# Altium schematic sheet LC_EXT_SCH.SchDoc: DEVCELL_V1
size A3; ApprovedBy: ?; CheckedBy: ?; Author: T.Suleymanli; CompanyName: SKA; DrawnBy: T.Suleymanli; Engineer: T.Suleymanli; Organization: SKA; Address1: Warszawa; DocumentNumber: #1; SheetNumber: 1; SheetTotal: 1
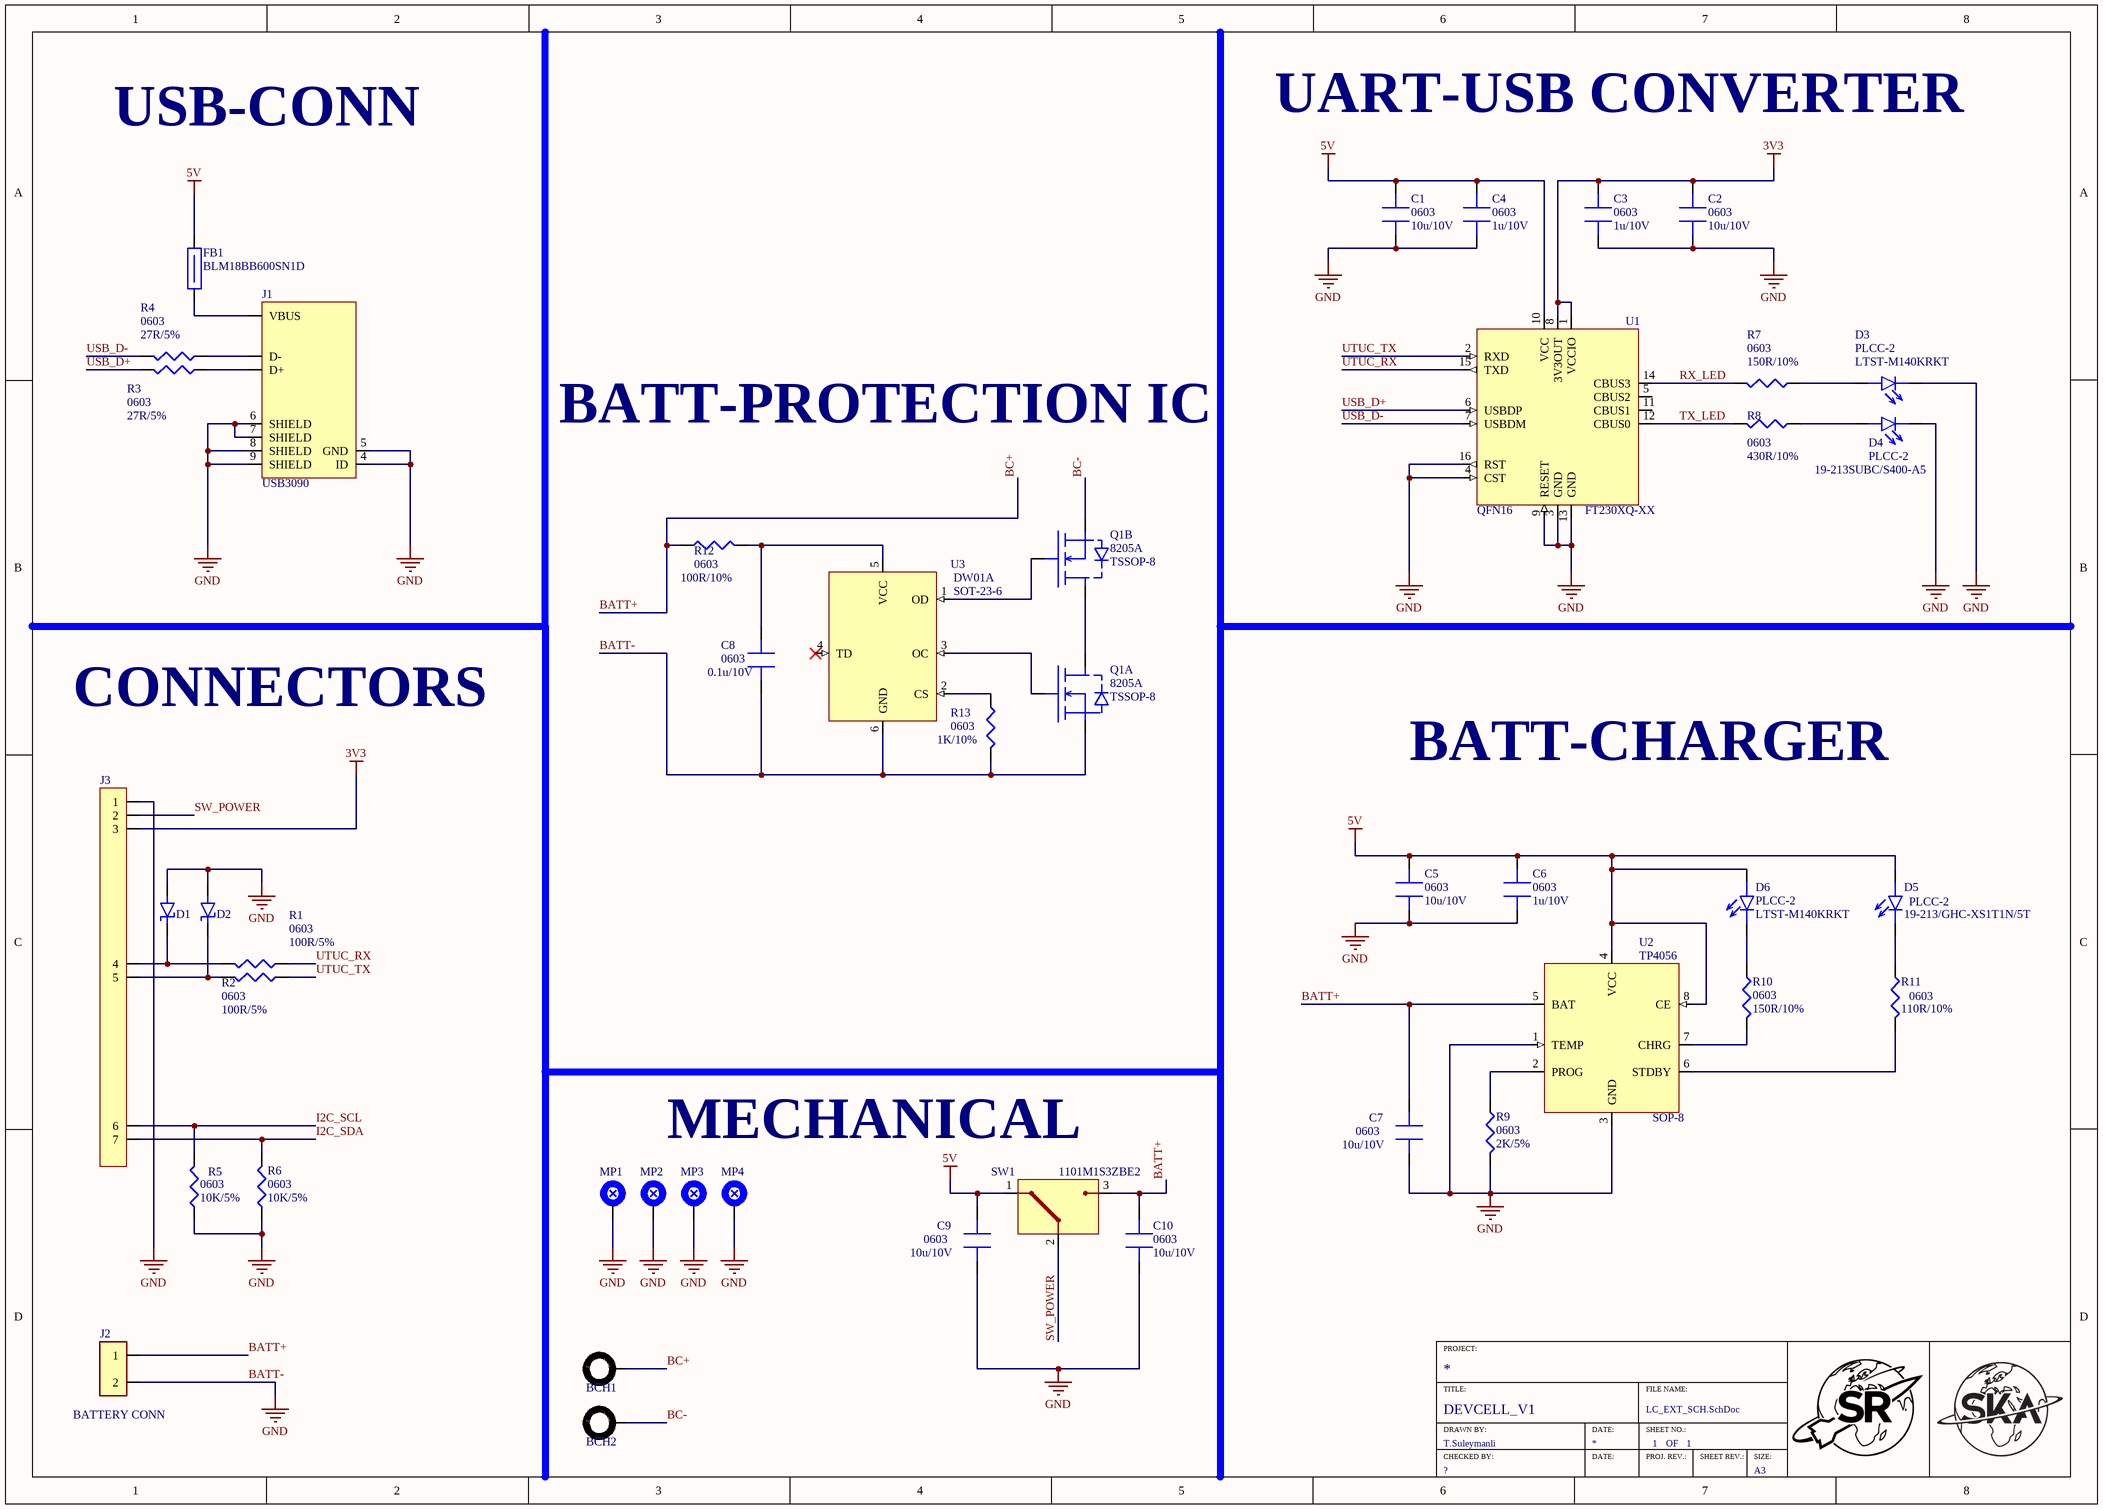
[diagram p0: LC_EXT_SCH.SchDoc]

## Parts
BCH1  BATTERY_CONNECTION_HOLE  [BATTERY_CONN_HOLE]  (value not drawn)
BCH2  BATTERY_CONNECTION_HOLE  [BATTERY_CONN_HOLE]  (value not drawn)
C1  value 10u/10V  Package: 0603  [CAPC1005X06L [0402]]  (hidden comment: C)
C2  value 10u/10V  Package: 0603  [CAPC1005X06L [0402]]  (hidden comment: C)
C3  value 1u/10V  Package: 0603  [CAPC1005X06L [0402]]  (hidden comment: C)
C4  value 1u/10V  Package: 0603  [CAPC1005X06L [0402]]  (hidden comment: C)
C5  value 10u/10V  Package: 0603  [CAPC1005X06L [0402]]  (hidden comment: C)
C6  value 1u/10V  Package: 0603  [CAPC1005X06L [0402]]  (hidden comment: C)
C7  value 10u/10V  Package: 0603  [CAPC1005X06L [0402]]  (hidden comment: C)
C8  value 0.1u/10V  Package: 0603  [CAPC1005X06L [0402]]  (hidden comment: C)
C9  value 10u/10V  Package: 0603  [CAPC1005X06L [0402]]  (hidden comment: C)
C10  value 10u/10V  Package: 0603  [CAPC1005X06L [0402]]  (hidden comment: C)
D1  ESD5Z2.5T1G  [SODFL160X60-2N]  (value not drawn)
D2  ESD5Z2.5T1G  [SODFL160X60-2N]  (value not drawn)
D3  Package: PLCC-2  [LEDC1608X35N]  (hidden comment: LTST-M140KRKT)
D4  Package: PLCC-2  PN: 19-213SUBC/S400-A5  [19-213/GHC-XS1T1N/5T]  (hidden comment: 19-213SUBC/S400-A5/S208-2/TR8)
D5  Package: PLCC-2  [19-213/GHC-XS1T1N/5T]  (hidden comment: 19-213/GHC-XS1T1N/5T)
D6  Package: PLCC-2  [LEDC1608X35N]  (hidden comment: LTST-M140KRKT)
FB1  BLM18BB600SN1D  [BEADC1608X95N]
J1  USB3090  [USB3090-2888209]
J2  BATTERY CONN  [DG30825402P1400AH]
J3  Female_Header x7  [Female Header]  (value not drawn)
MP1  Mounting hole  [Mounting_hole_M3]  (value not drawn)
MP2  Mounting hole  [Mounting_hole_M3]  (value not drawn)
MP3  Mounting hole  [Mounting_hole_M3]  (value not drawn)
MP4  Mounting hole  [Mounting_hole_M3]  (value not drawn)
Q1  8205A  Package: TSSOP-8  [TSOP65P610X120-8M]  (parts A,B of 2)
R1  value 100R/5%  Package: 0603  [RESC1005X04L [0402]]  (hidden comment: R)
R2  value 100R/5%  Package: 0603  [RESC1005X04L [0402]]  (hidden comment: R)
R3  value 27R/5%  Package: 0603  [RESC1005X04L [0402]]  (hidden comment: R)
R4  value 27R/5%  Package: 0603  [RESC1005X04L [0402]]  (hidden comment: R)
R5  value 10K/5%  Package: 0603  [RESC1608X06M[0603]]  (hidden comment: R)
R6  value 10K/5%  Package: 0603  [RESC1608X06M[0603]]  (hidden comment: R)
R7  value 150R/10%  Package: 0603  [RESC1005X04L [0402]]  (hidden comment: R)
R8  value 430R/10%  Package: 0603  [RESC1005X04L [0402]]  (hidden comment: R)
R9  value 2K/5%  Package: 0603  [RESC1005X04L [0402]]  (hidden comment: R)
R10  value 150R/10%  Package: 0603  [RESC1005X04L [0402]]  (hidden comment: R)
R11  value 110R/10%  Package: 0603  [RESC1005X04L [0402]]  (hidden comment: R)
R12  value 100R/10%  Package: 0603  [RESC1005X04L [0402]]  (hidden comment: R)
R13  value 1K/10%  Package: 0603  [RESC1005X04L [0402]]  (hidden comment: R)
SW1  1101M1S3ZBE2  [1101M1S3ZBE2]
U1  FT230XQ-XX  Package: QFN16  [QFN65P400X400X75_HS-17N]
U2  TP4056  Package: SOP-8  [SOP127P600X170-8N]
U3  DW01A  Package: SOT-23-6  [SOT95P270X145-6M]

## Nets
3V3: C2.1 C3.1 J3.3 U1.1(VCCIO) U1.8(3V3OUT)
5V: C1.1 C4.1 C5.1 C6.1 C9.1 D5.2 D6.2 FB1.2 SW1.1(5V) U1.10(VCC) U2.4(VCC) U2.8(CE)
BATT-: C1.2 C2.2 C3.2 C4.2 C5.2 C6.2 C7.2 C8.2 C9.2 C10.2 D1.2(A) D2.2(A) D3.1 D4.1 J1.4(ID) J1.5(GND) J1.6(SHIELD) J1.7(SHIELD) J1.8(SHIELD) J1.9(SHIELD) J2.2 J3.1 MP1.1 MP2.1 MP3.1 MP4.1 Q1.2(S1) R5.2 R6.2 R9.1 R13.1 U1.3(GND) U1.4(CST) U1.9(RESET) U1.13(GND) U1.16(RST) U2.1(TEMP) U2.3(GND) U3.6(GND)  [also labelled GND]
BATT+: BCH1.1 C7.1 C10.1 J2.1 R12.2 SW1.3(BATT+) U2.5(BAT)  [also labelled BC+]
BC-: BCH2.1 Q1.7(S2)
I2C_SCL: J3.6 R5.1
I2C_SDA: J3.7 R6.1
RX_LED: R7.1 U1.14(CBUS3)
SW_POWER: J3.2 SW1.2(COM)
TX_LED: R8.1 U1.12(CBUS0)
USB_D+: R3.1 U1.6(USBDP)
USB_D-: R4.1 U1.7(USBDM)
UTUC_RX: R1.2 U1.15(TXD)
UTUC_TX: R2.2 U1.2(RXD)
NetC8_1: C8.1 R12.1 U3.5(VCC)
NetD1_1: D1.1(C) J3.4 R1.1
NetD2_1: D2.1(C) J3.5 R2.1
NetD3_2: D3.2 R7.2
NetD4_2: D4.2 R8.2
NetD5_1: D5.1 R11.2
NetD6_1: D6.1 R10.2
NetFB1_1: FB1.1 J1.1(VBUS)
NetJ1_2: J1.2(D-) R4.2
NetJ1_3: J1.3(D+) R3.2
NetQ1_1: Q1.1(D1) Q1.8(D2)
NetQ1_4: Q1.4(G1) U3.3(OC)
NetQ1_5: Q1.5(G2) U3.1(OD)
NetR9_2: R9.2 U2.2(PROG)
NetR10_1: R10.1 U2.7(CHRG)
NetR11_1: R11.1 U2.6(STDBY)
NetR13_2: R13.2 U3.2(CS)

Not connected (* = marked no-connect by the designer): U1 5(CBUS2) 11(CBUS1); U3 4(TD)*

## Notes on the sheet
- USB-CONN
- UART-USB CONVERTER
- BATT-PROTECTION IC
- CONNECTORS
- BATT-CHARGER
- MECHANICAL
- TITLE:
- PROJECT:
- FILE NAME:
- DRAWN BY:
- CHECKED BY:
- DATE:
- SHEET NO.:
- PROJ. REV.:
- OF
- SHEET REV.:
- SIZE:
- A3

## Library data of the parts
BCH1 BCH2 = BATTERY_CONNECTION_HOLE: Pin hole for battery connection
C1-C10 = C: Standard capacitor
D1 D2 = D_Zener: ESD protection diode, 4V; Datasheet: https://www.onsemi.com/pdf/datasheet/esd5z2.5t1-d.pdf; Package: SOD−523; PN: ESD5Z2.5T1G
D3 D6 = sLED: LED; SMD; 3014; red; 0.24÷0.84lm; 90÷280mcd; 3x1.4x1.2mm; 120°; 20mA; HelpURL: https://www.tme.eu/en/details/ltst-m140krkt/smd-colour-leds/liteon/; PN: LTST-M140KRKT
D4 = sLED: LED; SMD; blue; 10÷32mcd; 1.6x0.8x0.6mm; 120°; 2.7÷3.1V; 5mA; 40mW; HelpURL: https://www.tme.eu/pl/en/details/19-213subc_s400-a5/smd-colour-leds/everlight/19-213subc-s400-a5-s208-2-tr8/
D5 = sLED: LED; SMD; 1608; green; 180÷360mcd; 1.6x0.8x0.6mm; 120°; 2.7÷3.7V; HelpURL: https://www.tme.eu/en/details/19-213_ghc-xs1t1n/smd-colour-leds/everlight/19-213-ghc-xs1t1n-5t/; PN: 19-213/GHC-XS1T1N/5T
FB1 = Ferrite Bead: Ferrite: bead; Imp.@ 100MHz: 60Ω; SMD; 0.55A; 0603; R: 0.25Ω; HELP_URL: https://www.tme.eu/en/details/blm18bb600sn1d/ferrite-beads/murata/; Datasheet: https://www.tme.eu/Document/8f5edfdc7dc6af1cef7fc1d27ee2b555/blm18bb750sn1d.pdf
J1 = USB3090-30-A: USB Connectors Micro A/B Skt,Bottom-SMT, R/A, 30u No Peg, W/shell stake,T&R; HELP_URL: https://www.tme.eu/pl/en/details/usb3090-30-a/usb-ieee1394-connectors/global-connector-technology-gct/; Datasheet: https://www.tme.eu/Document/251c0827d93b07f0b8f9232981ec431f/USB3090-30-A.pdf
J2 = BATTERY CONN: Standard battery connector for Li Ion battery
J3 = Female_Header: Header connectors x7 with 2.54 pitch
R1-R13 = R: Standard resistor
SW1 = 1101M1S3ZBE2: Switch: slide; Pos: 2; SPDT; 0.02A/20VAC; 0.02A/20VDC; ON-ON; 1000; HELP_URL: https://www.tme.eu/en/details/1101m1s3zbe2/slide-switches/c-k/; Datasheet: https://www.tme.eu/Document/db7738c833adf907315725e2b7045b58/1101M1S3CQE2.PDF
U1 = FT230XQ-T: USB Interface IC USB to Basic Serial UART IC QFN-16; Datasheet: https://www.tme.eu/Document/93b0911297f91fbab90e758d2cc33bdf/DS_FT230X.pdf; Help_URL: https://www.tme.eu/pl/en/details/ft230xq-t/usb-interfaces-integrated-circuits/ftdi/
U2 = TP4056-42-SOP8-PP: 1A Standalone Linear Li-lon Battery Charger with Thermal / Regulation; Datasheet: https://dlnmh9ip6v2uc.cloudfront.net/datasheets/Prototyping/TP4056.pdf
U3 = DW01A: Battery protection IC, SOT-23-6, 4.3V± 50mV, -40°C ~ +85°C; Datasheet: https://hmsemi.com/downfile/DW01A.PDF
Q1 = 8205A: Datasheet: https://datasheet.lcsc.com/lcsc/1810151911_Guangdong-Hottech-8205A_C181100.pdf